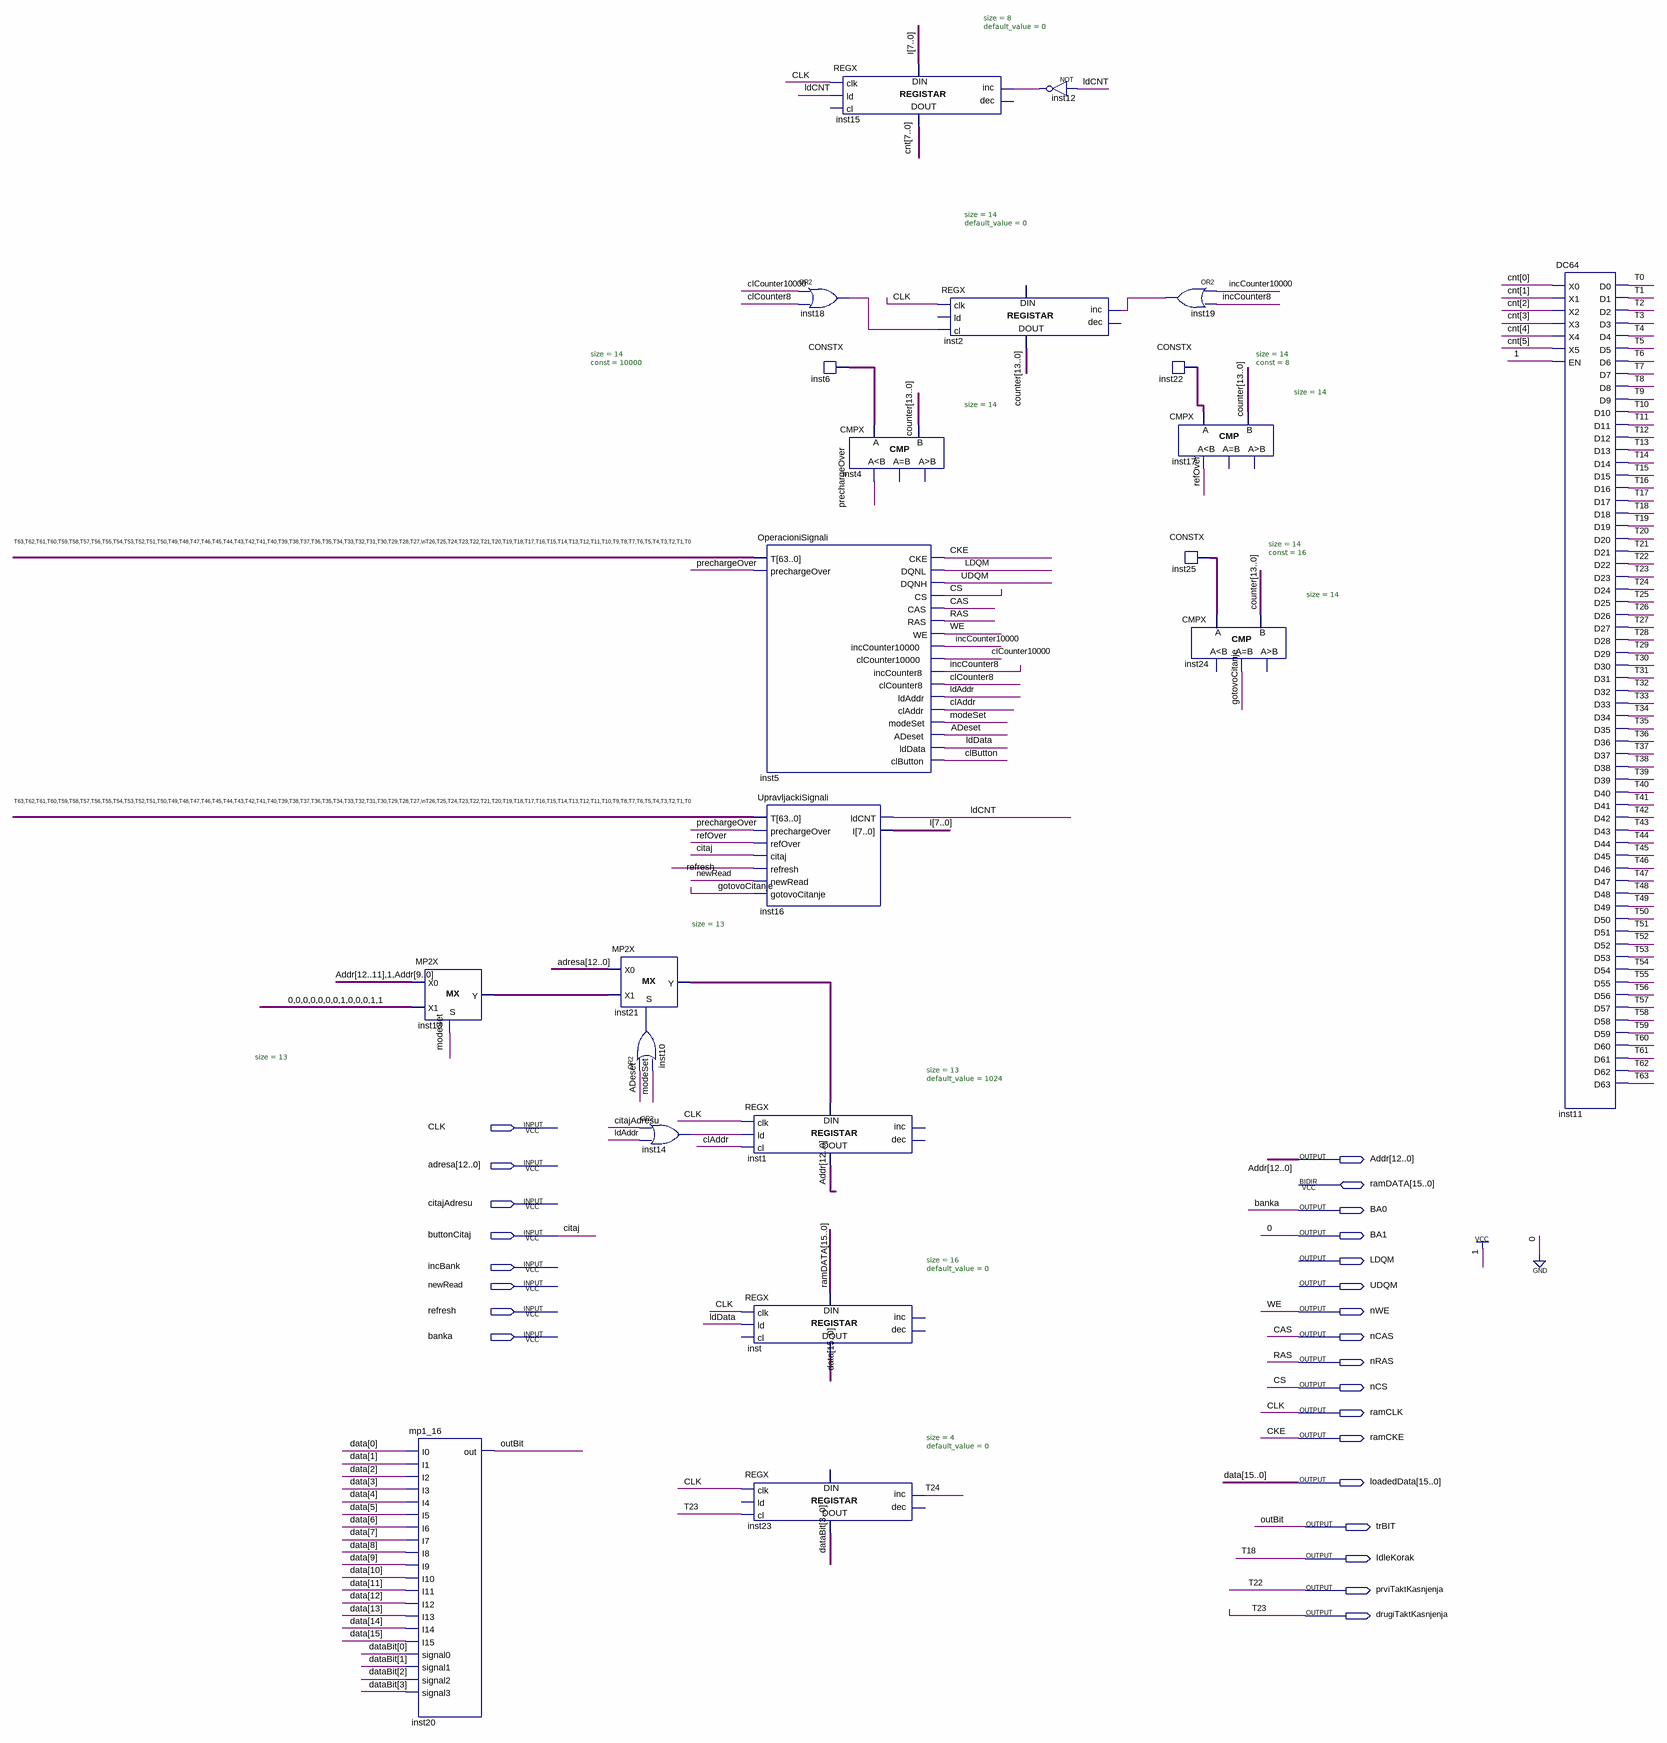
[diagram p0: schematic sheet]
// Quartus schematic SdRam.bdf as structural Verilog: 22 symbols, 25 pins
module SdRam (
  input  CLK,
  input  [12:0] adresa,
  input  citajAdresu,
  input  buttonCitaj,
  input  incBank,
  input  newRead,
  input  refresh,
  input  banka,
  inout  [15:0] ramDATA,
  output [12:0] Addr,
  output BA0,
  output BA1,
  output LDQM,
  output UDQM,
  output nWE,
  output nCAS,
  output nRAS,
  output nCS,
  output ramCLK,
  output ramCKE,
  output [15:0] loadedData,
  output trBIT,
  output IdleKorak,
  output prviTaktKasnjenja,
  output drugiTaktKasnjenja
);

  wire \\nT26 , ADeset, clAddr, clButton, clCounter8, clCounter10000, gotovoCitanje, incCounter8,
       incCounter10000, inst10_out, inst12_out, inst14_out, inst18_out, inst19_out, ldAddr, ldCNT, ldData,
       modeSet, prechargeOver, refOver, T0, T1, T2, T3, T4, T5, T6, T7, T8, T9, T10, T11, T12, T13, T14, T15,
       T16, T17, T19, T20, T21, T24, T25, T26, T27, T28, T29, T30, T31, T32, T33, T34, T35, T36, T37, T38,
       T39, T40, T41, T42, T43, T44, T45, T46, T47, T48, T49, T50, T51, T52, T53, T54, T55, T56, T57, T58,
       T59, T60, T61, T62, T63;
  wire [3:0] dataBit;
  wire [7:0] cnt, I;
  wire [12:0] inst13_y, inst21_y;
  wire [13:0] counter, inst6_data, inst22_data, inst25_data;

  MP2X #(.size(13)) inst13 (.S(modeSet), .X0({Addr[12:11], 1'b1, Addr[9:0]}), .X1(13'b0000000100011), .Y(inst13_y));
  mp1_16 inst20 (
    .I0(loadedData[0]), .I1(loadedData[1]), .I2(loadedData[2]), .I3(loadedData[3]), .I4(loadedData[4]),
    .I5(loadedData[5]), .I6(loadedData[6]), .I7(loadedData[7]), .I8(loadedData[8]), .I9(loadedData[9]),
    .I10(loadedData[10]), .I11(loadedData[11]), .I12(loadedData[12]), .I13(loadedData[13]),
    .I14(loadedData[14]), .I15(loadedData[15]), .signal0(dataBit[0]), .signal1(dataBit[1]),
    .signal2(dataBit[2]), .signal3(dataBit[3]), .out(trBIT));
  MP2X #(.size(13)) inst21 (.S(inst10_out), .X0(adresa), .X1(inst13_y), .Y(inst21_y));
  or inst10 (inst10_out, ADeset, modeSet);
  or inst14 (inst14_out, citajAdresu, ldAddr);
  OperacioniSignali inst5 (
    .T({T63, T62, T61, T60, T59, T58, T57, T56, T55, T54, T53, T52, T51, T50, T49, T48, T47, T46, T45, T44, T43, T42, T41, T40, T39, T38, T37, T36, T35, T34, T33, T32, T31, T30, T29, T28, T27, \\nT26 , T25, T24, drugiTaktKasnjenja, prviTaktKasnjenja, T21, T20, T19, IdleKorak, T17, T16, T15, T14, T13, T12, T11, T10, T9, T8, T7, T6, T5, T4, T3, T2, T1, T0}),
    .prechargeOver(prechargeOver), .CKE(ramCKE), .DQNL(LDQM), .DQNH(UDQM), .CS(nCS), .CAS(nCAS), .RAS(nRAS),
    .WE(nWE), .incCounter10000(incCounter10000), .clCounter10000(clCounter10000), .incCounter8(incCounter8),
    .clCounter8(clCounter8), .ldAddr(ldAddr), .clAddr(clAddr), .modeSet(modeSet), .ADeset(ADeset),
    .ldData(ldData), .clButton(clButton));
  UpravljackiSignali inst16 (
    .T({T63, T62, T61, T60, T59, T58, T57, T56, T55, T54, T53, T52, T51, T50, T49, T48, T47, T46, T45, T44, T43, T42, T41, T40, T39, T38, T37, T36, T35, T34, T33, T32, T31, T30, T29, T28, T27, \\nT26 , T25, T24, drugiTaktKasnjenja, prviTaktKasnjenja, T21, T20, T19, IdleKorak, T17, T16, T15, T14, T13, T12, T11, T10, T9, T8, T7, T6, T5, T4, T3, T2, T1, T0}),
    .prechargeOver(prechargeOver), .refOver(refOver), .citaj(buttonCitaj), .refresh(refresh),
    .newRead(newRead), .gotovoCitanje(gotovoCitanje), .ldCNT(ldCNT), .I(I));
  REGX #(.size(13), .default_value(1024)) inst1 (
    .clk(CLK), .ld(inst14_out), .cl(clAddr), .data_in(inst21_y), .data_out(Addr));  // open: inc, dec
  REGX #(.size(16), .default_value(0)) inst (
    .clk(CLK), .ld(ldData), .data_in(ramDATA), .data_out(loadedData));  // open: cl, inc, dec
  REGX #(.size(4), .default_value(0)) inst23 (
    .clk(CLK), .cl(drugiTaktKasnjenja), .inc(T24), .data_out(dataBit));  // open: ld, dec, data_in
  or inst18 (inst18_out, clCounter10000, clCounter8);
  CONSTX #(.size(14), .\const (10000)) inst6 (.data(inst6_data));
  REGX #(.size(8), .default_value(0)) inst15 (
    .clk(CLK), .ld(ldCNT), .inc(inst12_out), .data_in(I), .data_out(cnt));  // open: cl, dec
  CMPX #(.size(14)) inst4 (.A(inst6_data), .B(counter), .ls(prechargeOver));  // open: eq, gr
  REGX #(.size(14), .default_value(0)) inst2 (
    .clk(CLK), .cl(inst18_out), .inc(inst19_out), .data_out(counter));  // open: ld, dec, data_in
  not inst12 (inst12_out, ldCNT);
  or inst19 (inst19_out, incCounter10000, incCounter8);
  CONSTX #(.size(14), .\const (8)) inst22 (.data(inst22_data));
  CMPX #(.size(14)) inst17 (.A(inst22_data), .B(counter), .ls(refOver));  // open: eq, gr
  CONSTX #(.size(14), .\const (16)) inst25 (.data(inst25_data));
  CMPX #(.size(14)) inst24 (.A(inst25_data), .B(counter), .eq(gotovoCitanje));  // open: ls, gr
  DC64 inst11 (
    .X0(cnt[0]), .X1(cnt[1]), .X2(cnt[2]), .X3(cnt[3]), .X4(cnt[4]), .X5(cnt[5]), .EN(1'b1), .D0(T0),
    .D1(T1), .D2(T2), .D3(T3), .D4(T4), .D5(T5), .D6(T6), .D7(T7), .D8(T8), .D9(T9), .D10(T10), .D11(T11),
    .D12(T12), .D13(T13), .D14(T14), .D15(T15), .D16(T16), .D17(T17), .D18(IdleKorak), .D19(T19), .D20(T20),
    .D21(T21), .D22(prviTaktKasnjenja), .D23(drugiTaktKasnjenja), .D24(T24), .D25(T25), .D26(T26), .D27(T27),
    .D28(T28), .D29(T29), .D30(T30), .D31(T31), .D32(T32), .D33(T33), .D34(T34), .D35(T35), .D36(T36),
    .D37(T37), .D38(T38), .D39(T39), .D40(T40), .D41(T41), .D42(T42), .D43(T43), .D44(T44), .D45(T45),
    .D46(T46), .D47(T47), .D48(T48), .D49(T49), .D50(T50), .D51(T51), .D52(T52), .D53(T53), .D54(T54),
    .D55(T55), .D56(T56), .D57(T57), .D58(T58), .D59(T59), .D60(T60), .D61(T61), .D62(T62), .D63(T63));

  assign BA0 = banka;
  assign BA1 = 1'b0;
  assign ramCLK = CLK;

  // Other names for the same wires on the sheet: CAS = nCAS; citaj = buttonCitaj; CKE = ramCKE; CS = nCS;
  //   data[15:0] = loadedData; outBit = trBIT; RAS = nRAS; T18 = IdleKorak; T22 = prviTaktKasnjenja;
  //   T23 = drugiTaktKasnjenja; WE = nWE
endmodule
